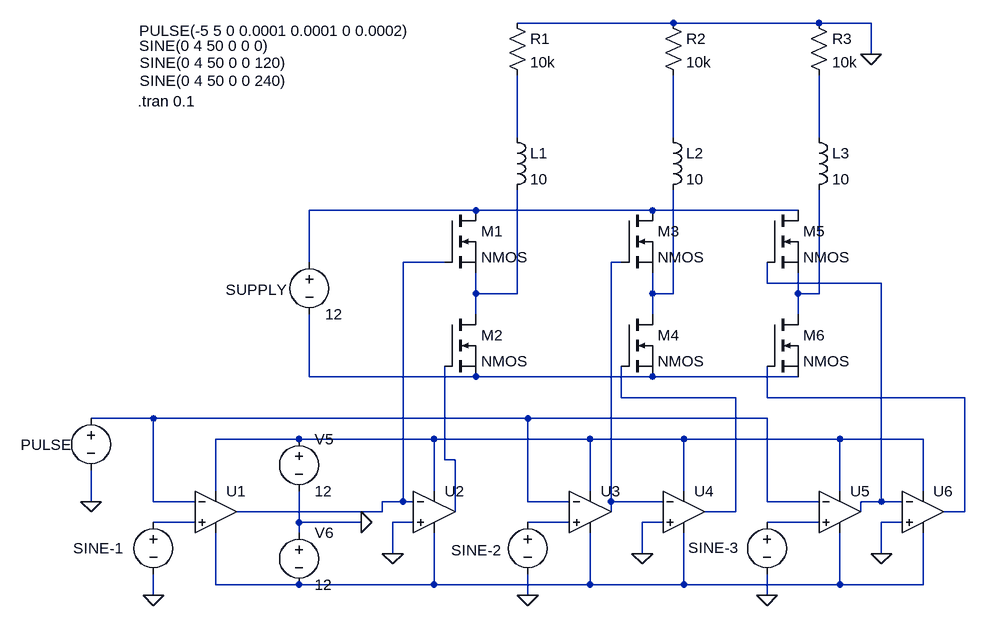
[diagram p0: schematic DC-to-3Phase.asc]
DC-to-3Phase.asc, the LTspice schematic file:
Version 4.1
SHEET 1 1988 1284
WIRE 240 -368 0 -368
WIRE 464 -368 240 -368
WIRE 544 -368 464 -368
WIRE 544 -320 544 -368
WIRE 0 -192 0 -288
WIRE 240 -192 240 -288
WIRE 464 -192 464 -288
WIRE -64 -80 -320 -80
WIRE 208 -80 -64 -80
WIRE 432 -80 208 -80
WIRE -320 0 -320 -80
WIRE -112 0 -176 0
WIRE 160 0 144 0
WIRE 384 32 384 0
WIRE 560 32 384 32
WIRE -64 48 -64 16
WIRE 0 48 0 -112
WIRE 0 48 -64 48
WIRE 208 48 208 16
WIRE 240 48 240 -112
WIRE 240 48 208 48
WIRE 432 48 432 16
WIRE 464 48 464 -112
WIRE 464 48 432 48
WIRE -64 80 -64 48
WIRE 208 80 208 48
WIRE 432 80 432 48
WIRE -320 176 -320 80
WIRE -64 176 -320 176
WIRE 208 176 -64 176
WIRE 432 176 208 176
WIRE 160 208 160 160
WIRE 336 208 160 208
WIRE 384 208 384 160
WIRE 688 208 384 208
WIRE -560 240 -656 240
WIRE 16 240 -560 240
WIRE 384 240 16 240
WIRE -336 272 -464 272
WIRE -128 272 -336 272
WIRE 112 272 -128 272
WIRE 256 272 112 272
WIRE 496 272 256 272
WIRE 624 272 496 272
WIRE -112 304 -112 160
WIRE -96 304 -112 304
WIRE -464 352 -464 272
WIRE -128 352 -128 272
WIRE 112 352 112 272
WIRE 256 352 256 272
WIRE 496 352 496 272
WIRE 624 352 624 272
WIRE -656 368 -656 320
WIRE -560 368 -560 240
WIRE -496 368 -560 368
WIRE -176 368 -176 0
WIRE -176 368 -208 368
WIRE -160 368 -176 368
WIRE 16 368 16 240
WIRE 80 368 16 368
WIRE 144 368 144 0
WIRE 224 368 144 368
WIRE 384 368 384 240
WIRE 464 368 384 368
WIRE 560 368 560 32
WIRE 560 368 528 368
WIRE 592 368 560 368
WIRE -208 384 -208 368
WIRE -208 384 -432 384
WIRE -96 384 -96 304
WIRE 144 384 144 368
WIRE 336 384 336 208
WIRE 336 384 288 384
WIRE 528 384 528 368
WIRE 688 384 688 208
WIRE 688 384 656 384
WIRE -496 400 -560 400
WIRE -336 400 -336 352
WIRE -240 400 -336 400
WIRE -160 400 -192 400
WIRE 80 400 16 400
WIRE 224 400 192 400
WIRE 464 400 384 400
WIRE 592 400 560 400
WIRE -336 416 -336 400
WIRE -192 448 -192 400
WIRE 192 448 192 400
WIRE 560 448 560 400
WIRE -464 496 -464 416
WIRE -336 496 -464 496
WIRE -128 496 -128 416
WIRE -128 496 -336 496
WIRE 112 496 112 416
WIRE 112 496 -128 496
WIRE 256 496 256 416
WIRE 256 496 112 496
WIRE 496 496 496 416
WIRE 496 496 256 496
WIRE 624 496 624 416
WIRE 624 496 496 496
WIRE -560 512 -560 480
WIRE 16 512 16 480
WIRE 384 512 384 480
FLAG -240 400 0
FLAG -656 368 0
FLAG -560 512 0
FLAG -192 448 0
FLAG 16 512 0
FLAG 192 448 0
FLAG 384 512 0
FLAG 560 448 0
FLAG 544 -320 0
SYMBOL voltage -560 384 R0
WINDOW 3 -22 -717 Left 2
WINDOW 123 0 0 Left 0
WINDOW 39 0 0 Left 0
WINDOW 0 -123 56 Left 2
SYMATTR Value SINE(0 4 50 0 0 0)
SYMATTR InstName SINE-1
SYMBOL OpAmps\\UniversalOpAmp2 -464 384 R0
SYMATTR InstName U1
SYMBOL OpAmps\\UniversalOpAmp2 -128 384 R0
SYMATTR InstName U2
SYMBOL voltage -336 256 R0
WINDOW 123 0 0 Left 0
WINDOW 39 0 0 Left 0
SYMATTR InstName V5
SYMATTR Value 12
SYMBOL voltage -336 400 R0
WINDOW 123 0 0 Left 0
WINDOW 39 0 0 Left 0
SYMATTR InstName V6
SYMATTR Value 12
SYMBOL voltage -656 224 R0
WINDOW 123 0 0 Left 0
WINDOW 39 0 0 Left 0
WINDOW 0 -108 57 Left 2
WINDOW 3 74 -580 Left 2
SYMATTR InstName PULSE
SYMATTR Value PULSE(-5 5 0 0.0001 0.0001 0 0.0002)
SYMBOL voltage 16 384 R0
WINDOW 3 -597 -691 Left 2
WINDOW 123 0 0 Left 0
WINDOW 39 0 0 Left 0
WINDOW 0 -118 59 Left 2
SYMATTR Value SINE(0 4 50 0 0 120)
SYMATTR InstName SINE-2
SYMBOL OpAmps\\UniversalOpAmp2 112 384 R0
SYMATTR InstName U3
SYMBOL OpAmps\\UniversalOpAmp2 256 384 R0
SYMATTR InstName U4
SYMBOL voltage 384 384 R0
WINDOW 3 -965 -663 Left 2
WINDOW 123 0 0 Left 0
WINDOW 39 0 0 Left 0
WINDOW 0 -121 55 Left 2
SYMATTR Value SINE(0 4 50 0 0 240)
SYMATTR InstName SINE-3
SYMBOL OpAmps\\UniversalOpAmp2 496 384 R0
SYMATTR InstName U5
SYMBOL OpAmps\\UniversalOpAmp2 624 384 R0
SYMATTR InstName U6
SYMBOL voltage -320 -16 R0
WINDOW 0 -129 58 Left 2
WINDOW 123 0 0 Left 0
WINDOW 39 0 0 Left 0
SYMATTR InstName SUPPLY
SYMATTR Value 12
SYMBOL nmos -112 -80 R0
SYMATTR InstName M1
SYMBOL nmos -112 80 R0
SYMATTR InstName M2
SYMBOL nmos 160 -80 R0
SYMATTR InstName M3
SYMBOL nmos 160 80 R0
SYMATTR InstName M4
SYMBOL nmos 384 -80 R0
SYMATTR InstName M5
SYMBOL nmos 384 80 R0
SYMATTR InstName M6
SYMBOL res -16 -384 R0
SYMATTR InstName R1
SYMATTR Value 10k
SYMBOL res 224 -384 R0
SYMATTR InstName R2
SYMATTR Value 10k
SYMBOL res 448 -384 R0
SYMATTR InstName R3
SYMATTR Value 10k
SYMBOL ind -16 -208 R0
SYMATTR InstName L1
SYMATTR Value 10
SYMBOL ind 224 -208 R0
SYMATTR InstName L2
SYMATTR Value 10
SYMBOL ind 448 -208 R0
SYMATTR InstName L3
SYMATTR Value 10
TEXT -584 -248 Left 2 !.tran 0.1

The netlist it stands for:
* DC-to-3Phase.asc
V§SINE-1 N017 0 SINE(0 4 50 0 0 0)
X§U1 N017 N014 N015 N020 N005 level2 Avol=1Meg GBW=10Meg Slew=10Meg Ilimit=25m Rail=0 Vos=0 En=0 Enk=0 In=0 Ink=0 Rin=500Meg  ; pins In+ In- V+ V- OUT
X§U2 0 N005 N015 N020 N016 level2 Avol=1Meg GBW=10Meg Slew=10Meg Ilimit=25m Rail=0 Vos=0 En=0 Enk=0 In=0 Ink=0 Rin=500Meg  ; pins In+ In- V+ V- OUT
V5 N015 0 12
V6 0 N020 12
V§PULSE N014 0 PULSE(-5 5 0 0.0001 0.0001 0 0.0002)
V§SINE-2 N018 0 SINE(0 4 50 0 0 120)
X§U3 N018 N014 N015 N020 N006 level2 Avol=1Meg GBW=10Meg Slew=10Meg Ilimit=25m Rail=0 Vos=0 En=0 Enk=0 In=0 Ink=0 Rin=500Meg  ; pins In+ In- V+ V- OUT
X§U4 0 N006 N015 N020 N012 level2 Avol=1Meg GBW=10Meg Slew=10Meg Ilimit=25m Rail=0 Vos=0 En=0 Enk=0 In=0 Ink=0 Rin=500Meg  ; pins In+ In- V+ V- OUT
V§SINE-3 N019 0 SINE(0 4 50 0 0 240)
X§U5 N019 N014 N015 N020 N007 level2 Avol=1Meg GBW=10Meg Slew=10Meg Ilimit=25m Rail=0 Vos=0 En=0 Enk=0 In=0 Ink=0 Rin=500Meg  ; pins In+ In- V+ V- OUT
X§U6 0 N007 N015 N020 N013 level2 Avol=1Meg GBW=10Meg Slew=10Meg Ilimit=25m Rail=0 Vos=0 En=0 Enk=0 In=0 Ink=0 Rin=500Meg  ; pins In+ In- V+ V- OUT
V§SUPPLY N004 N011 12
M1 N004 N005 N008 N008 NMOS
M2 N008 N016 N011 N011 NMOS
M3 N004 N006 N009 N009 NMOS
M4 N009 N012 N011 N011 NMOS
M5 N004 N007 N010 N010 NMOS
M6 N010 N013 N011 N011 NMOS
R1 0 N001 10k
R2 0 N002 10k
R3 0 N003 10k
L1 N001 N008 10
L2 N002 N009 10
L3 N003 N010 10
.model NMOS NMOS
.model PMOS PMOS
.lib standard.mos
.tran 0.1
.lib UniversalOpAmp2.lib
.backanno
.end